# Altium schematic sheet Direction Pad_SCHEMATIC.SchDoc
size A4; SheetNumber: 3; SheetTotal: 5
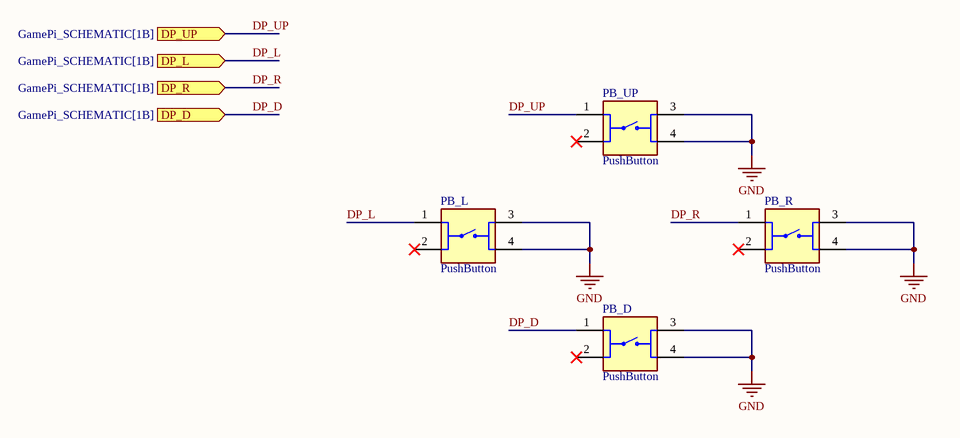
[diagram p0: Direction Pad_SCHEMATIC.SchDoc]

## Parts
PB_D  PushButton  [Push Button]
PB_L  PushButton  [Push Button]
PB_R  PushButton  [Push Button]
PB_UP  PushButton  [Push Button]

## Ports
DP_D (in, see GamePi_SCHEMATIC[1B]), DP_L (in, see GamePi_SCHEMATIC[1B]), DP_R (in, see GamePi_SCHEMATIC[1B]), DP_UP (in, see GamePi_SCHEMATIC[1B])

## Nets
GND: PB_D.3 PB_D.4 PB_L.3 PB_L.4 PB_R.3 PB_R.4 PB_UP.3 PB_UP.4
DP_D: PB_D.1 ; port DP_D
DP_L: PB_L.1 ; port DP_L
DP_R: PB_R.1 ; port DP_R
DP_UP: PB_UP.1 ; port DP_UP

Not connected (* = marked no-connect by the designer): PB_D 2*; PB_L 2*; PB_R 2*; PB_UP 2*